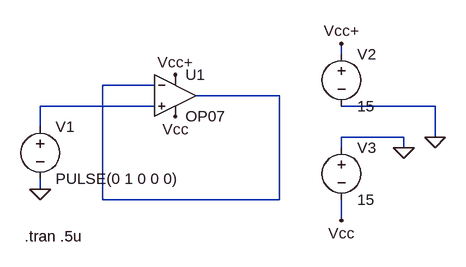
[diagram p0: schematic Slew rate vs finite Bandwidth.asc]
Slew rate vs finite Bandwidth.asc, the LTspice schematic file:
Version 4
SHEET 1 880 680
WIRE 320 32 320 16
WIRE 32 80 -48 80
WIRE 224 96 96 96
WIRE 32 112 -144 112
WIRE 464 112 320 112
WIRE -144 144 -144 112
WIRE 416 160 320 160
WIRE 464 160 464 112
WIRE 320 176 320 160
WIRE 416 176 416 160
WIRE -144 240 -144 224
WIRE -48 256 -48 80
WIRE 224 256 224 96
WIRE 224 256 -48 256
WIRE 320 288 320 256
FLAG -144 240 0
FLAG 64 64 Vcc+
FLAG 64 128 Vcc
FLAG 320 288 Vcc
FLAG 416 176 0
FLAG 464 160 0
FLAG 320 16 Vcc+
SYMBOL Opamps\\OP07 64 32 R0
SYMATTR InstName U1
SYMBOL voltage -144 128 R0
WINDOW 123 0 0 Left 2
WINDOW 39 0 0 Left 2
SYMATTR InstName V1
SYMATTR Value PULSE(0 1 0 0 0)
SYMBOL voltage 320 16 R0
WINDOW 123 0 0 Left 2
WINDOW 39 0 0 Left 2
SYMATTR InstName V2
SYMATTR Value 15
SYMBOL voltage 320 160 R0
WINDOW 123 0 0 Left 2
WINDOW 39 0 0 Left 2
SYMATTR InstName V3
SYMATTR Value 15
TEXT -168 312 Left 2 !.tran .5u

The netlist it stands for:
* Slew rate vs finite Bandwidth.asc
XU1 N002 N001 Vcc+ Vcc N001 LT1001  ; OP07, pins In+ In- V+ V- OUT
V1 N002 0 PULSE(0 1 0 0 0)
V2 Vcc+ 0 15
V3 0 Vcc 15
.tran .5u
.lib LTC.lib
.backanno
.end